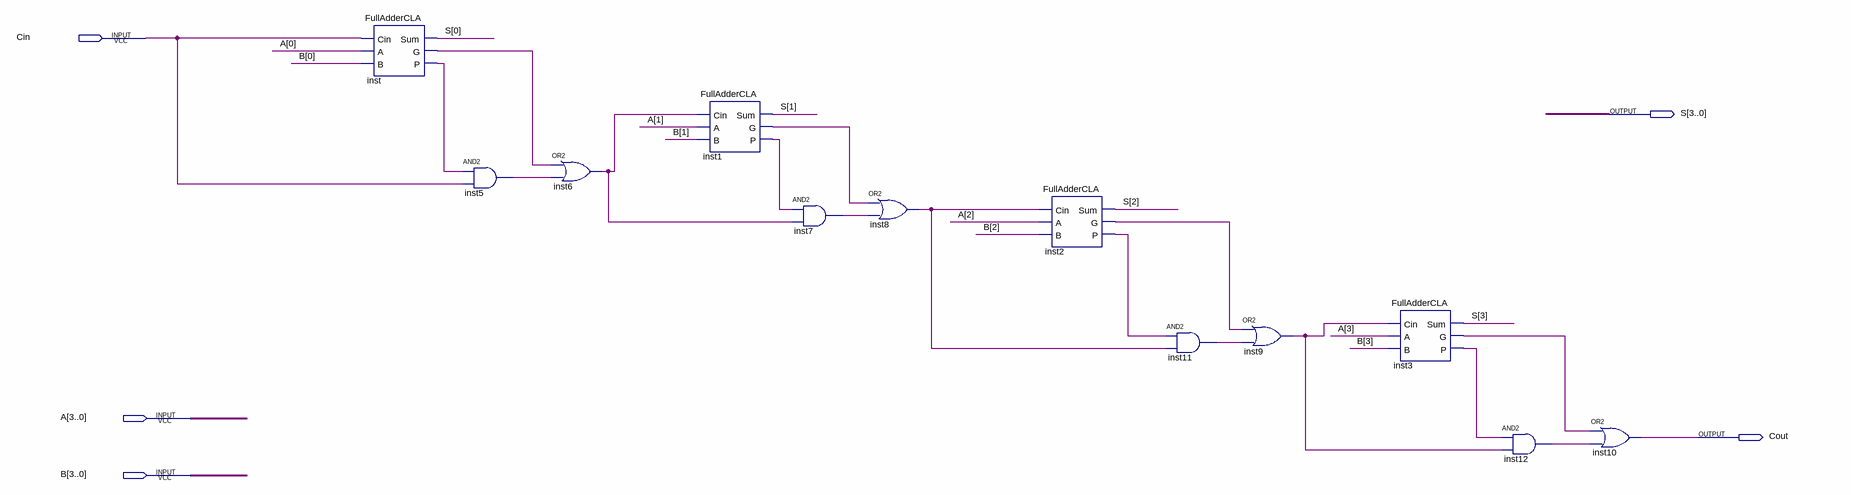
[diagram p0: schematic sheet]
// Quartus schematic FourBitAdderCLA.bdf as structural Verilog: 12 symbols, 5 pins
module FourBitAdderCLA (
  input  Cin,
  input  [3:0] A,
  input  [3:0] B,
  output [3:0] S,
  output Cout
);

  wire inst1_g, inst1_p, inst2_g, inst2_p, inst3_g, inst3_p, inst5_out, inst6_out, inst7_out, inst8_out,
       inst9_out, inst11_out, inst12_out, inst_g, inst_p;

  FullAdderCLA inst (.Cin(Cin), .A(A[0]), .B(B[0]), .Sum(S[0]), .G(inst_g), .P(inst_p));
  and inst5 (inst5_out, inst_p, Cin);
  or inst6 (inst6_out, inst_g, inst5_out);
  FullAdderCLA inst1 (.Cin(inst6_out), .A(A[1]), .B(B[1]), .Sum(S[1]), .G(inst1_g), .P(inst1_p));
  and inst7 (inst7_out, inst1_p, inst6_out);
  or inst8 (inst8_out, inst1_g, inst7_out);
  FullAdderCLA inst2 (.Cin(inst8_out), .A(A[2]), .B(B[2]), .Sum(S[2]), .G(inst2_g), .P(inst2_p));
  and inst11 (inst11_out, inst2_p, inst8_out);
  or inst9 (inst9_out, inst2_g, inst11_out);
  FullAdderCLA inst3 (.Cin(inst9_out), .A(A[3]), .B(B[3]), .Sum(S[3]), .G(inst3_g), .P(inst3_p));
  and inst12 (inst12_out, inst3_p, inst9_out);
  or inst10 (Cout, inst3_g, inst12_out);
endmodule
